# Altium schematic sheet YB03CQ31552(数据板）SPI.SchDoc
size A3
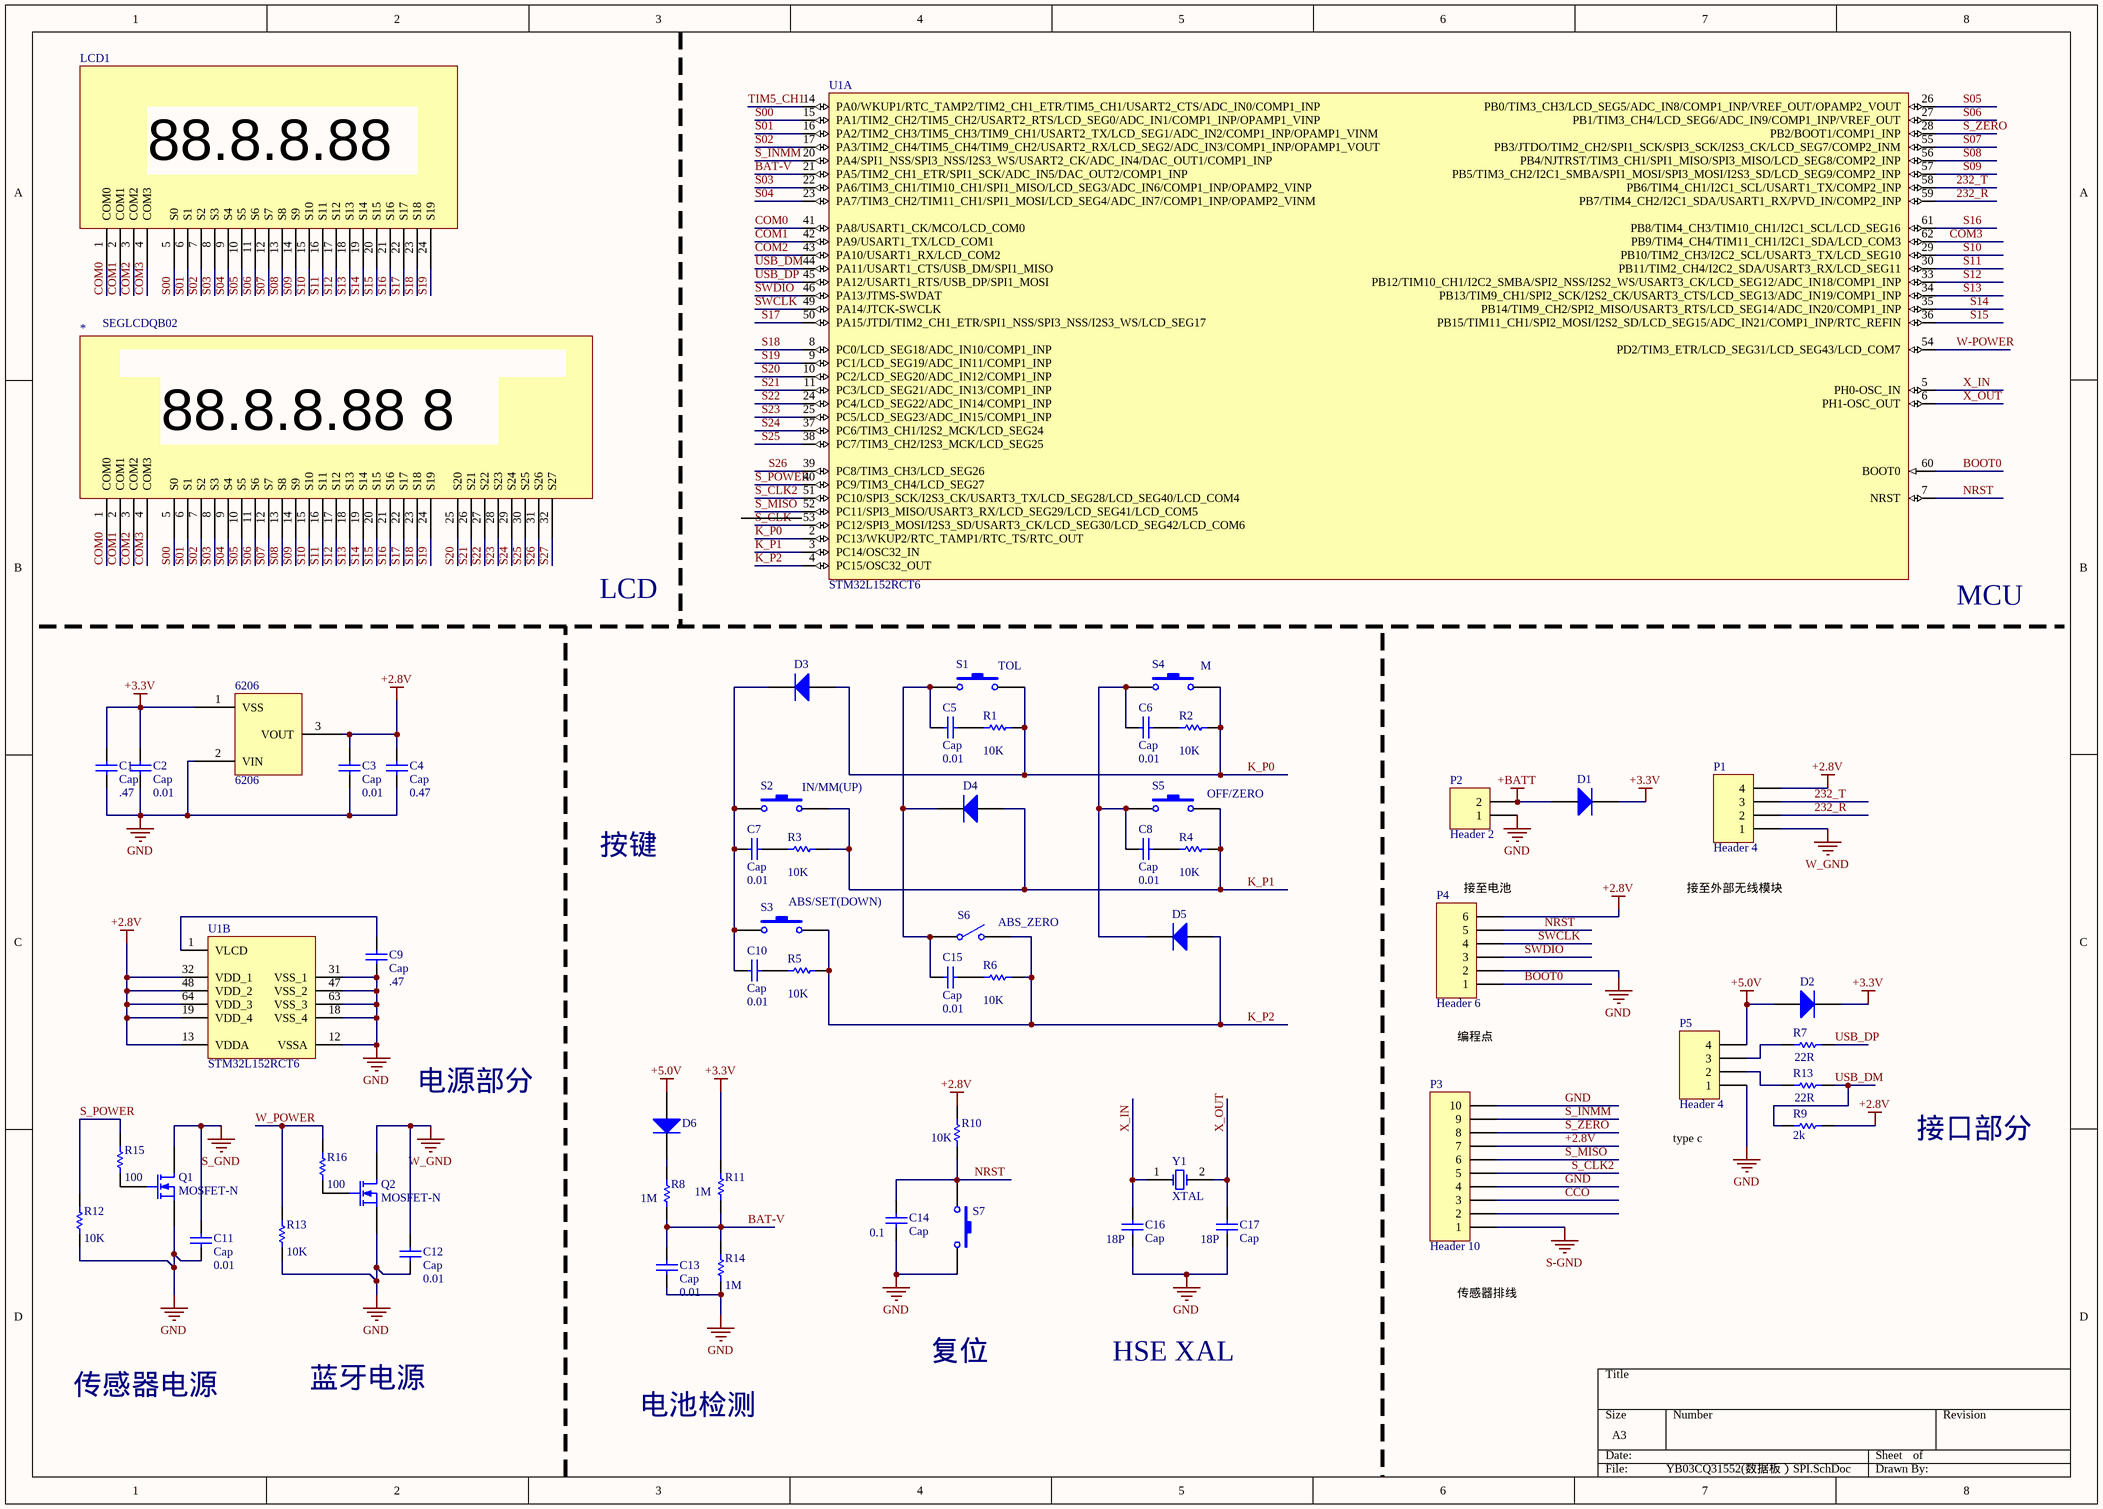
[diagram p0: YB03CQ31552(数据板）SPI.SchDoc]

## Parts
(Parts that share a designator on the sheet are numbered #1, #2 ... from top to bottom, then left to right.)
6206  6206  [sot-23]
*  SEGLCDQB02
C1  Cap  value .47  [RAD-0.3]
C2  Cap  value 0.01  [RAD-0.3]
C3  Cap  value 0.01  [RAD-0.3]
C4  Cap  value 0.47  [RAD-0.3]
C5  Cap  value 0.01  [RAD-0.3]
C6  Cap  value 0.01  [RAD-0.3]
C7  Cap  value 0.01  [RAD-0.3]
C8  Cap  value 0.01  [RAD-0.3]
C9  Cap  value .47  [RAD-0.3]
C10  Cap  value 0.01  [RAD-0.3]
C11  Cap  value 0.01  [RAD-0.3]
C12  Cap  value 0.01  [RAD-0.3]
C13  Cap  value 0.01  [RAD-0.3]
C14  Cap  value 0.1  [RAD-0.3]
C15  Cap  value 0.01  [RAD-0.3]
C16  Cap  value 18P  [RAD-0.3]
C17  Cap  value 18P  [RAD-0.3]
D1  Diode 1N4148  [DO-35]  (value not drawn)
D2  Diode 1N4148  [DO-35]  (value not drawn)
D3  Diode  [SMC]  (value not drawn)
D4  Diode  [SMC]  (value not drawn)
D5  Diode  [SMC]  (value not drawn)
D6  Diode  [SMC]  (value not drawn)
LCD1  (no value)
P1  Header 4  [HDR1X4]
P2  Header 2  [HDR1X2]
P3  Header 10  [HDR1X10]
P4  Header 6  [HDR1X6]
P5  Header 4  [HDR1X4]
Q1  MOSFET-N  [E3]
Q2  MOSFET-N  [E3]
R1  value 10K  [AXIAL-0.3]  (hidden comment: Res1)
R2  value 10K  [AXIAL-0.3]  (hidden comment: Res1)
R3  value 10K  [AXIAL-0.3]  (hidden comment: Res1)
R4  value 10K  [AXIAL-0.3]  (hidden comment: Res1)
R5  value 10K  [AXIAL-0.3]  (hidden comment: Res1)
R6  value 10K  [AXIAL-0.3]  (hidden comment: Res1)
R7  value 22R  [AXIAL-0.3]  (hidden comment: Res1)
R8  value 1M  [AXIAL-0.3]  (hidden comment: Res1)
R9  value 2k  [AXIAL-0.3]  (hidden comment: Res1)
R10  value 10K  [AXIAL-0.3]  (hidden comment: Res1)
R11  value 1M  [AXIAL-0.3]  (hidden comment: Res1)
R12  value 10K  [AXIAL-0.3]  (hidden comment: Res1)
R13#1  value 22R  [AXIAL-0.3]  (hidden comment: Res1)
R13#2  value 10K  [AXIAL-0.3]  (hidden comment: Res1)
R14  value 1M  [AXIAL-0.3]  (hidden comment: Res1)
R15  value 100  [AXIAL-0.3]  (hidden comment: Res1)
R16  value 100  [AXIAL-0.3]  (hidden comment: Res1)
S1  TOL  [SPST-2]
S2  IN/MM(UP)  [SPST-2]
S3  ABS/SET(DOWN)  [SPST-2]
S4  M  [SPST-2]
S5  OFF/ZERO  [SPST-2]
S6  ABS_ZERO  [SPST-2]
S7  NRST  [SPST-2]  (value not drawn)
U1  STM32L152RCT6  [STM-LQFP64_N]  (parts A,B of 2)
Y1  XTAL  [R38]

## Nets
+2.8V: 6206.3(VOUT) C3.2 C4.2 P1.4 P3.7 P4.6 R9.2 R10.2 U1.13(VDDA) U1.19(VDD_4) U1.32(VDD_1) U1.48(VDD_2) U1.64(VDD_3)
+3.3V: 6206.1(VSS) C1.2 C2.1 D1.2(K) D2.2(K) R11.2
+5.0V: D2.1(A) D6.1(A) P5.4
+BATT: D1.1(A) P2.2
GND: 6206.2(VIN) C1.1 C2.2 C3.1 C4.1 C9.2 C11.1 C12.1 C13.1 C14.1 C16.1 C17.1 P2.1 P3.4 P3.10 P4.2 P5.1 Q1.3(S) Q2.3(S) R12.1 R13#2.1 R14.1 S7.2 U1.12(VSSA) U1.18(VSS_4) U1.31(VSS_1) U1.47(VSS_2) U1.63(VSS_3)
S-GND: P3.1
S_GND: C11.2 Q1.1(D)
W_GND: C12.2 P1.1 Q2.1(D)
232_R: P1.2 U1.59(PB7/TIM4_CH2/I2C1_SDA/USART1_RX/PVD_IN/COMP2_INP)
232_T: P1.3 U1.58(PB6/TIM4_CH1/I2C1_SCL/USART1_TX/COMP2_INP)
BAT-V: C13.2 R8.1 R11.1 R14.2 U1.21(PA5/TIM2_CH1_ETR/SPI1_SCK/ADC_IN5/DAC_OUT2/COMP1_INP)
BOOT0: P4.1 U1.60(BOOT0)
CCO: P3.3
COM0: *.1(COM0) LCD1.1(COM0) U1.41(PA8/USART1_CK/MCO/LCD_COM0)
COM1: *.2(COM1) LCD1.2(COM1) U1.42(PA9/USART1_TX/LCD_COM1)
COM2: *.3(COM2) LCD1.3(COM2) U1.43(PA10/USART1_RX/LCD_COM2)
COM3: *.4(COM3) LCD1.4(COM3) U1.62(PB9/TIM4_CH4/TIM11_CH1/I2C1_SDA/LCD_COM3)
K_P0: D3.1(A) R1.1 R2.1 S1.2 S4.2 U1.2(PC13/WKUP2/RTC_TAMP1/RTC_TS/RTC_OUT)
K_P1: D4.1(A) R3.1 R4.1 S2.2 S5.2 U1.3(PC14/OSC32_IN)
K_P2: D5.1(A) R5.1 R6.1 S3.2 S6.2(NO) U1.4(PC15/OSC32_OUT)
NRST: C14.2 P4.5 R10.1 S7.1 U1.7(NRST)
S00: *.5(S0) LCD1.5(S0) U1.15(PA1/TIM2_CH2/TIM5_CH2/USART2_RTS/LCD_SEG0/ADC_IN1/COMP1_INP/OPAMP1_VINP)
S01: *.6(S1) LCD1.6(S1) U1.16(PA2/TIM2_CH3/TIM5_CH3/TIM9_CH1/USART2_TX/LCD_SEG1/ADC_IN2/COMP1_INP/OPAMP1_VINM)
S02: *.7(S2) LCD1.7(S2) U1.17(PA3/TIM2_CH4/TIM5_CH4/TIM9_CH2/USART2_RX/LCD_SEG2/ADC_IN3/COMP1_INP/OPAMP1_VOUT)
S03: *.8(S3) LCD1.8(S3) U1.22(PA6/TIM3_CH1/TIM10_CH1/SPI1_MISO/LCD_SEG3/ADC_IN6/COMP1_INP/OPAMP2_VINP)
S04: *.9(S4) LCD1.9(S4) U1.23(PA7/TIM3_CH2/TIM11_CH1/SPI1_MOSI/LCD_SEG4/ADC_IN7/COMP1_INP/OPAMP2_VINM)
S05: *.10(S5) LCD1.10(S5) U1.26(PB0/TIM3_CH3/LCD_SEG5/ADC_IN8/COMP1_INP/VREF_OUT/OPAMP2_VOUT)
S06: *.11(S6) LCD1.11(S6) U1.27(PB1/TIM3_CH4/LCD_SEG6/ADC_IN9/COMP1_INP/VREF_OUT)
S07: *.12(S7) LCD1.12(S7) U1.55(PB3/JTDO/TIM2_CH2/SPI1_SCK/SPI3_SCK/I2S3_CK/LCD_SEG7/COMP2_INM)
S08: *.13(S8) LCD1.13(S8) U1.56(PB4/NJTRST/TIM3_CH1/SPI1_MISO/SPI3_MISO/LCD_SEG8/COMP2_INP)
S09: *.14(S9) LCD1.14(S9) U1.57(PB5/TIM3_CH2/I2C1_SMBA/SPI1_MOSI/SPI3_MOSI/I2S3_SD/LCD_SEG9/COMP2_INP)
S10: *.15(S10) LCD1.15(S10) U1.29(PB10/TIM2_CH3/I2C2_SCL/USART3_TX/LCD_SEG10)
S11: *.16(S11) LCD1.16(S11) U1.30(PB11/TIM2_CH4/I2C2_SDA/USART3_RX/LCD_SEG11)
S12: *.17(S12) LCD1.17(S12) U1.33(PB12/TIM10_CH1/I2C2_SMBA/SPI2_NSS/I2S2_WS/USART3_CK/LCD_SEG12/ADC_IN18/COMP1_INP)
S13: *.18(S13) LCD1.18(S13) U1.34(PB13/TIM9_CH1/SPI2_SCK/I2S2_CK/USART3_CTS/LCD_SEG13/ADC_IN19/COMP1_INP)
S14: *.19(S14) LCD1.19(S14) U1.35(PB14/TIM9_CH2/SPI2_MISO/USART3_RTS/LCD_SEG14/ADC_IN20/COMP1_INP)
S15: *.20(S15) LCD1.20(S15) U1.36(PB15/TIM11_CH1/SPI2_MOSI/I2S2_SD/LCD_SEG15/ADC_IN21/COMP1_INP/RTC_REFIN)
S16: *.21(S16) LCD1.21(S16) U1.61(PB8/TIM4_CH3/TIM10_CH1/I2C1_SCL/LCD_SEG16)
S17: *.22(S17) LCD1.22(S17) U1.50(PA15/JTDI/TIM2_CH1_ETR/SPI1_NSS/SPI3_NSS/I2S3_WS/LCD_SEG17)
S18: *.23(S18) LCD1.23(S18) U1.8(PC0/LCD_SEG18/ADC_IN10/COMP1_INP)
S19: *.24(S19) LCD1.24(S19) U1.9(PC1/LCD_SEG19/ADC_IN11/COMP1_INP)
S20: *.25(S20) U1.10(PC2/LCD_SEG20/ADC_IN12/COMP1_INP)
S21: *.26(S21) U1.11(PC3/LCD_SEG21/ADC_IN13/COMP1_INP)
S22: *.27(S22) U1.24(PC4/LCD_SEG22/ADC_IN14/COMP1_INP)
S23: *.28(S23) U1.25(PC5/LCD_SEG23/ADC_IN15/COMP1_INP)
S24: *.29(S24) U1.37(PC6/TIM3_CH1/I2S2_MCK/LCD_SEG24)
S25: *.30(S25) U1.38(PC7/TIM3_CH2/I2S3_MCK/LCD_SEG25)
S26: *.31(S26) U1.39(PC8/TIM3_CH3/LCD_SEG26)
S27: *.32(S27)
S_CLK: U1.53(PC12/SPI3_MOSI/I2S3_SD/USART3_CK/LCD_SEG30/LCD_SEG42/LCD_COM6)
S_CLK2: P3.5 U1.51(PC10/SPI3_SCK/I2S3_CK/USART3_TX/LCD_SEG28/LCD_SEG40/LCD_COM4)
S_INMM: P3.9 U1.20(PA4/SPI1_NSS/SPI3_NSS/I2S3_WS/USART2_CK/ADC_IN4/DAC_OUT1/COMP1_INP)
S_MISO: P3.6 U1.52(PC11/SPI3_MISO/USART3_RX/LCD_SEG29/LCD_SEG41/LCD_COM5)
S_POWER: R12.2 R15.1 U1.40(PC9/TIM3_CH4/LCD_SEG27)
S_ZERO: P3.8 U1.28(PB2/BOOT1/COMP1_INP)
SWCLK: P4.4 U1.49(PA14/JTCK-SWCLK)
SWDIO: P4.3 U1.46(PA13/JTMS-SWDAT)
TIM5_CH1: U1.14(PA0/WKUP1/RTC_TAMP2/TIM2_CH1_ETR/TIM5_CH1/USART2_CTS/ADC_IN0/COMP1_INP)
USB_DM: R9.1 R13#1.1 U1.44(PA11/USART1_CTS/USB_DM/SPI1_MISO)
USB_DP: R7.1 U1.45(PA12/USART1_RTS/USB_DP/SPI1_MOSI)
W-POWER: U1.54(PD2/TIM3_ETR/LCD_SEG31/LCD_SEG43/LCD_COM7)
W_POWER: R13#2.2 R16.1
X_IN: C16.2 U1.5(PH0-OSC_IN) Y1.1(OSC1)
X_OUT: C17.2 U1.6(PH1-OSC_OUT) Y1.2(OSC2)
NetC5_1: C5.1 C15.1 D4.2(K) S1.1 S6.1(COMMON)
NetC5_2: C5.2 R1.2
NetC6_1: C6.1 C8.1 D5.2(K) S4.1 S5.1
NetC6_2: C6.2 R2.2
NetC7_1: C7.1 C10.1 D3.2(K) S2.1 S3.1
NetC7_2: C7.2 R3.2
NetC8_2: C8.2 R4.2
NetC9_1: C9.1 U1.1(VLCD)
NetC10_2: C10.2 R5.2
NetC15_2: C15.2 R6.2
NetD6_2: D6.2(K) R8.2
NetP5_2: P5.2 R13#1.2
NetP5_3: P5.3 R7.2
NetQ1_2: Q1.2(G) R15.2
NetQ2_2: Q2.2(G) R16.2

Not connected (* = marked no-connect by the designer): P3 2

## Notes on the sheet
- LCD
- (near U1) MCU
- 按键
- (near P4) 接至电池
- 接至外部无线模块
- 编程点
- 电源部分
- (near P5) type c
- 接口部分
- 传感器排线
- 传感器电源
- 蓝牙电源
- 复位
- HSE XAL
- 电池检测
- (in symbol SEGLCDQB01) 88.8.8.88
- (in symbol SEGLCDQB02) ||||||||| | ||||||||||; 88.8.8.88 8

## Library data of the parts
6206 = 2606
C1-C17 = Cap: Capacitor; Published: 8-Jun-2000; LatestRevisionDate: 17-Jul-2002; LatestRevisionNote: Re-released for DXP Platform.; PackageReference: RAD-0.3; Publisher: Altium Limited; PackageDescription: Radial Cap, Thru-Hole; 2 Leads; 0.3 in Pin Spacing
D1 D2 = Diode 1N4148: High Conductance Fast Diode; Published: 8-Jun-2000; LatestRevisionDate: 17-Jul-2002; LatestRevisionNote: Re-released for DXP Platform.; DatasheetVersion: 1997; PackageReference: DO-35; Publisher: Altium Limited; PackageDescription: Diode, Axial; Body 3.8 x 1.9 mm (LxDia. max), Lead Dia. 0.53 mm (max); Code_JEDEC: DO-204-AH; ComponentLink1Description: Manufacturer Link; ComponentLink1URL: http://www.fairchildsemi.com/; ComponentLink2Description: Datasheet; ComponentLink2URL: http://www.fairchildsemi.com/ds/1N%2F1N4148.pdf
D3-D6 = Diode: Default Diode; Published: 8-Jun-2000; LatestRevisionDate: 17-Jul-2002; LatestRevisionNote: Re-released for DXP Platform.; PackageVersion: Sep-1996; PackageReference: SMC; Publisher: Altium Limited; PackageDescription: DO-214-AB/SMC; 2 C-Bend Leads; Body 7.9 x 5.9 mm, inc. leads (LxW); Code_JEDEC: DO-214-AB
LCD1 = SEGLCDQB01
P1 P5 = Header 4: Header, 4-Pin; LatestRevisionDate: 17-Jul-2002; LatestRevisionNote: Re-released for DXP Platform.; Publisher: Altium Limited
P2 = Header 2: Header, 2-Pin; LatestRevisionDate: 17-Jul-2002; LatestRevisionNote: Re-released for DXP Platform.; Publisher: Altium Limited
P3 = Header 10: Header, 10-Pin; LatestRevisionDate: 17-Jul-2002; LatestRevisionNote: Re-released for DXP Platform.; Publisher: Altium Limited
P4 = Header 6: Header, 6-Pin; LatestRevisionDate: 17-Jul-2002; LatestRevisionNote: Re-released for DXP Platform.; Publisher: Altium Limited
Q1 Q2 = MOSFET-N: N-Channel MOSFET; Published: 8-Jun-2000; LatestRevisionDate: 17-Jul-2002; LatestRevisionNote: Re-released for DXP Platform.; PackageVersion: 1995/1996; PackageReference: E3; Publisher: Altium Limited; PackageDescription: TO, Flat Index; 3 In-Line, Axial Leads; Body Dia. 4.6mm; Lead Dia. 0.5 mm (max)
R1-R12 R13#1 R13#2 R14-R16 = Res1: Resistor; Published: 8-Jun-2000; LatestRevisionDate: 17-Jul-2002; LatestRevisionNote: Re-released for DXP Platform.; PackageReference: AXIAL-0.3; Publisher: Altium Limited; PackageDescription: Axial Device, Thru-Hole; 2 Leads; 0.3 in Pin Spacing
S1-S5 S7 = SW-PB: Switch; Published: 24-Mar-1999; LatestRevisionDate: 17-Jul-2002; LatestRevisionNote: Re-released for DXP Platform.; PackageReference: SPST-2; Publisher: Altium Limited; PackageDescription: Switch; 2 Leads
S6 = SW-SPST: Single-Pole, Single-Throw Switch; Published: 24-Mar-1999; LatestRevisionDate: 17-Jul-2002; LatestRevisionNote: Re-released for DXP Platform.; PackageReference: SPST-2; Publisher: Altium Limited; PackageDescription: Switch; 2 Leads
U1 = STM32L152RCT6: ARM Cortex-M3 32-bit MCU, 256 KB Flash, 32 KB Internal RAM, 51 I/Os, 64-pin LQFP, -40 to 85 degC, Tray; Manufacturer: STMicroelectronics; D/A Converter: 2x12-bit (2 Channel); Data E2PROM nom (B): 8192; Display controller: LCD 4x32/8x28; FLASH Size (Prog) (kB): 256; I/Os (High Current): 51; Internal RAM Size (kB): 32; Supply Voltage(Vcc) min (V): 1.65; DatasheetVersion: Rev. 3; PackageVersion: Rev. 4, 06/2013; PackageReference: LQFP64; PackageDescription: 64-Pin Low Profile Quad Flat Package, 10 x 10 mm Body, 0.5 mm Pitch; Core: ARM Cortex-M3; Operating Frequency(F) (Processor speed) (MHz): 32; Packing: Tray; Mounting Technology: Surface Mount; PartNumber: STM32L152RCT6; ComponentLink1Description: Manufacturer URL; ComponentLink1URL: http://www.st.com/web/en/home.html; ComponentLink2Description: Datasheet; ComponentLink2URL: http://www.st.com/st-web-ui/static/active/en/resource/technical/document/datasheet/DM00048356.pdf; ComponentLink3Description: Package Specification; ComponentLink3URL: http://www.st.com/st-web-ui/static/active/en/resource/technical/document/datasheet/DM00037051.pdf
Y1 = XTAL: Crystal Oscillator; Published: 8-Jun-2000; LatestRevisionDate: 17-Jul-2002; LatestRevisionNote: Re-released for DXP Platform.; PackageReference: R38; Publisher: Altium Limited; PackageDescription: Crystal, Thru-Hole; 2 Leads; Body 3.1 x 8.2 mm (Dia.xH)